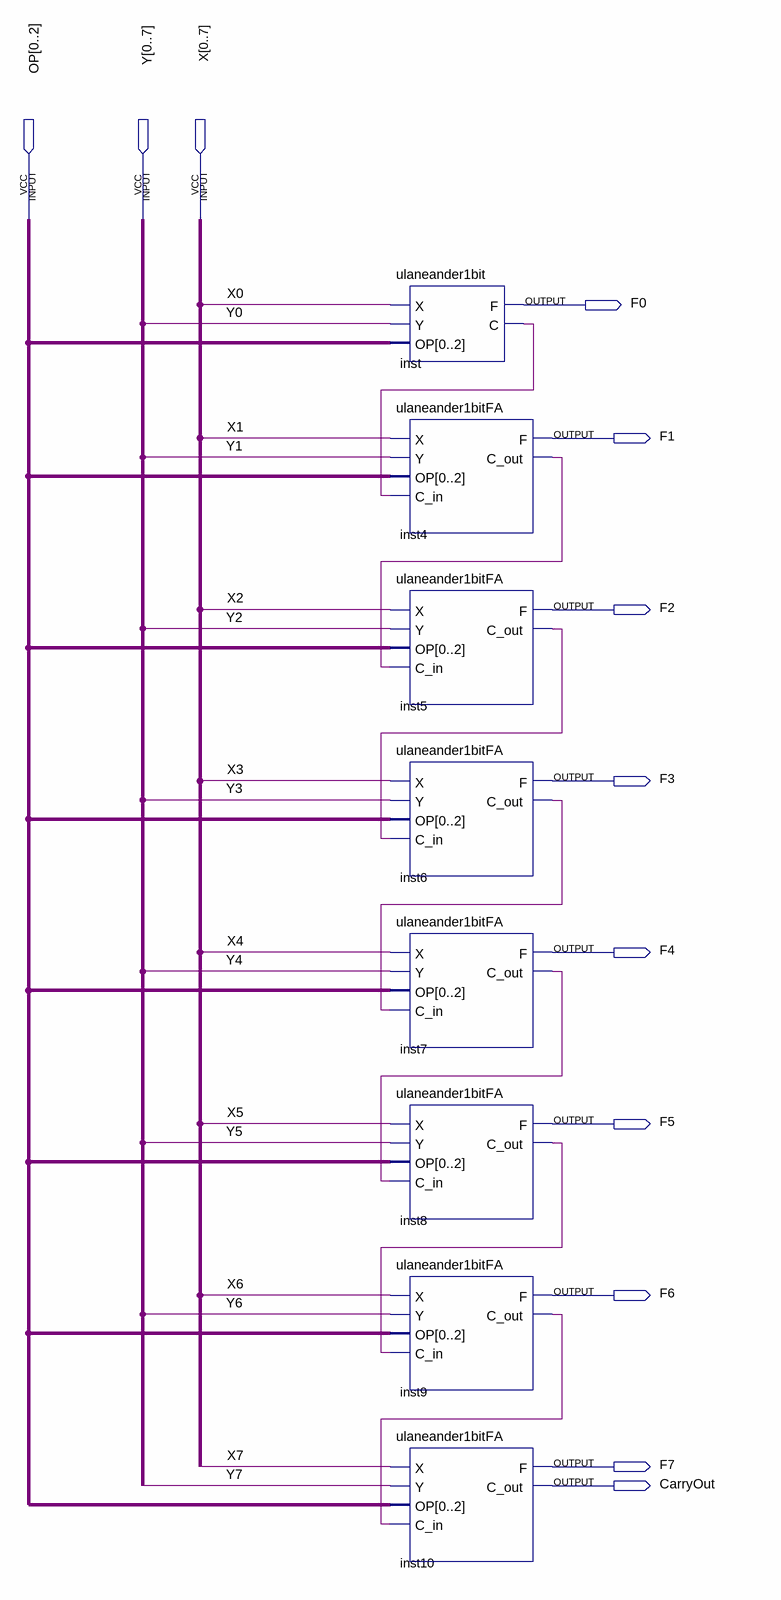
[diagram p0: schematic sheet]
// Quartus schematic ula_neander.bdf as structural Verilog: 8 symbols, 12 pins
module ula_neander (
  input  [0:2] OP,
  input  [0:7] Y,
  input  [0:7] X,
  output F0,
  output F1,
  output F2,
  output F3,
  output F4,
  output F5,
  output F6,
  output F7,
  output CarryOut
);

  wire inst4_c_out, inst5_c_out, inst6_c_out, inst7_c_out, inst8_c_out, inst9_c_out, inst_c;

  ulaneander1bit inst (.X(X[0]), .Y(Y[0]), .OP(OP), .F(F0), .C(inst_c));
  ulaneander1bitFA inst4 (.X(X[1]), .Y(Y[1]), .OP(OP), .C_in(inst_c), .F(F1), .C_out(inst4_c_out));
  ulaneander1bitFA inst5 (.X(X[2]), .Y(Y[2]), .OP(OP), .C_in(inst4_c_out), .F(F2), .C_out(inst5_c_out));
  ulaneander1bitFA inst6 (.X(X[3]), .Y(Y[3]), .OP(OP), .C_in(inst5_c_out), .F(F3), .C_out(inst6_c_out));
  ulaneander1bitFA inst7 (.X(X[4]), .Y(Y[4]), .OP(OP), .C_in(inst6_c_out), .F(F4), .C_out(inst7_c_out));
  ulaneander1bitFA inst8 (.X(X[5]), .Y(Y[5]), .OP(OP), .C_in(inst7_c_out), .F(F5), .C_out(inst8_c_out));
  ulaneander1bitFA inst9 (.X(X[6]), .Y(Y[6]), .OP(OP), .C_in(inst8_c_out), .F(F6), .C_out(inst9_c_out));
  ulaneander1bitFA inst10 (.X(X[7]), .Y(Y[7]), .OP(OP), .C_in(inst9_c_out), .F(F7), .C_out(CarryOut));
endmodule
